# Altium schematic sheet Interfaces.SchDoc: Interfaces
size A2; ApprovedBy: Yves Chevallier; CheckedBy: Yves Chevallier; Author: Yves Chevallier; CompanyName: HEIG-VD; DrawnBy: Yves Chevallier; Engineer: Yves Chevallier; Organization: HEIG-VD; Address1: HEIG-VD; Address2: CH1015 Lausanne; Address3: +41(0)21 693 36 98; Address4: +41(0)21 693 26 00; DocumentNumber: ABC.00.0000.000.0; Revision: v1.0; SheetNumber: 0; SheetTotal: 0; DrawnByDate: 2000-01-01; ExecutionWarrantDate: 2000-01-01; ExecutionWarrant: Yves Chevallier; Context: Confidential; PageSetup: Record=PageOptions|CenterHorizontal=True|CenterVertical=False|PrintScale=0.97|XCorrection=1.00|YCorrection=1.00|PrintKind=0|BorderSize=5000000|LeftOffset=0|BottomOffset=0|Orientation=2|PaperLength=1000|PaperWidth=1000|Scale=100|PaperSource=262|PrintQuality=600|MediaType=1|DitherType=10|PaperKind=A4|PrintScaleMode=1; EngineerDate: 2000-01-01; CheckedByDate: 2000-01-01; ProjectName: PRJ
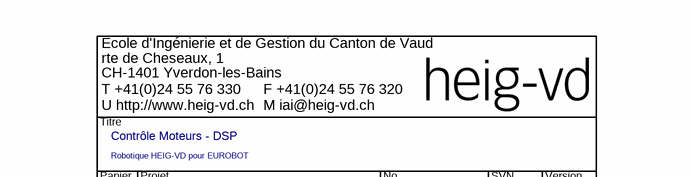
[diagram p0: Interfaces.SchDoc, top right]
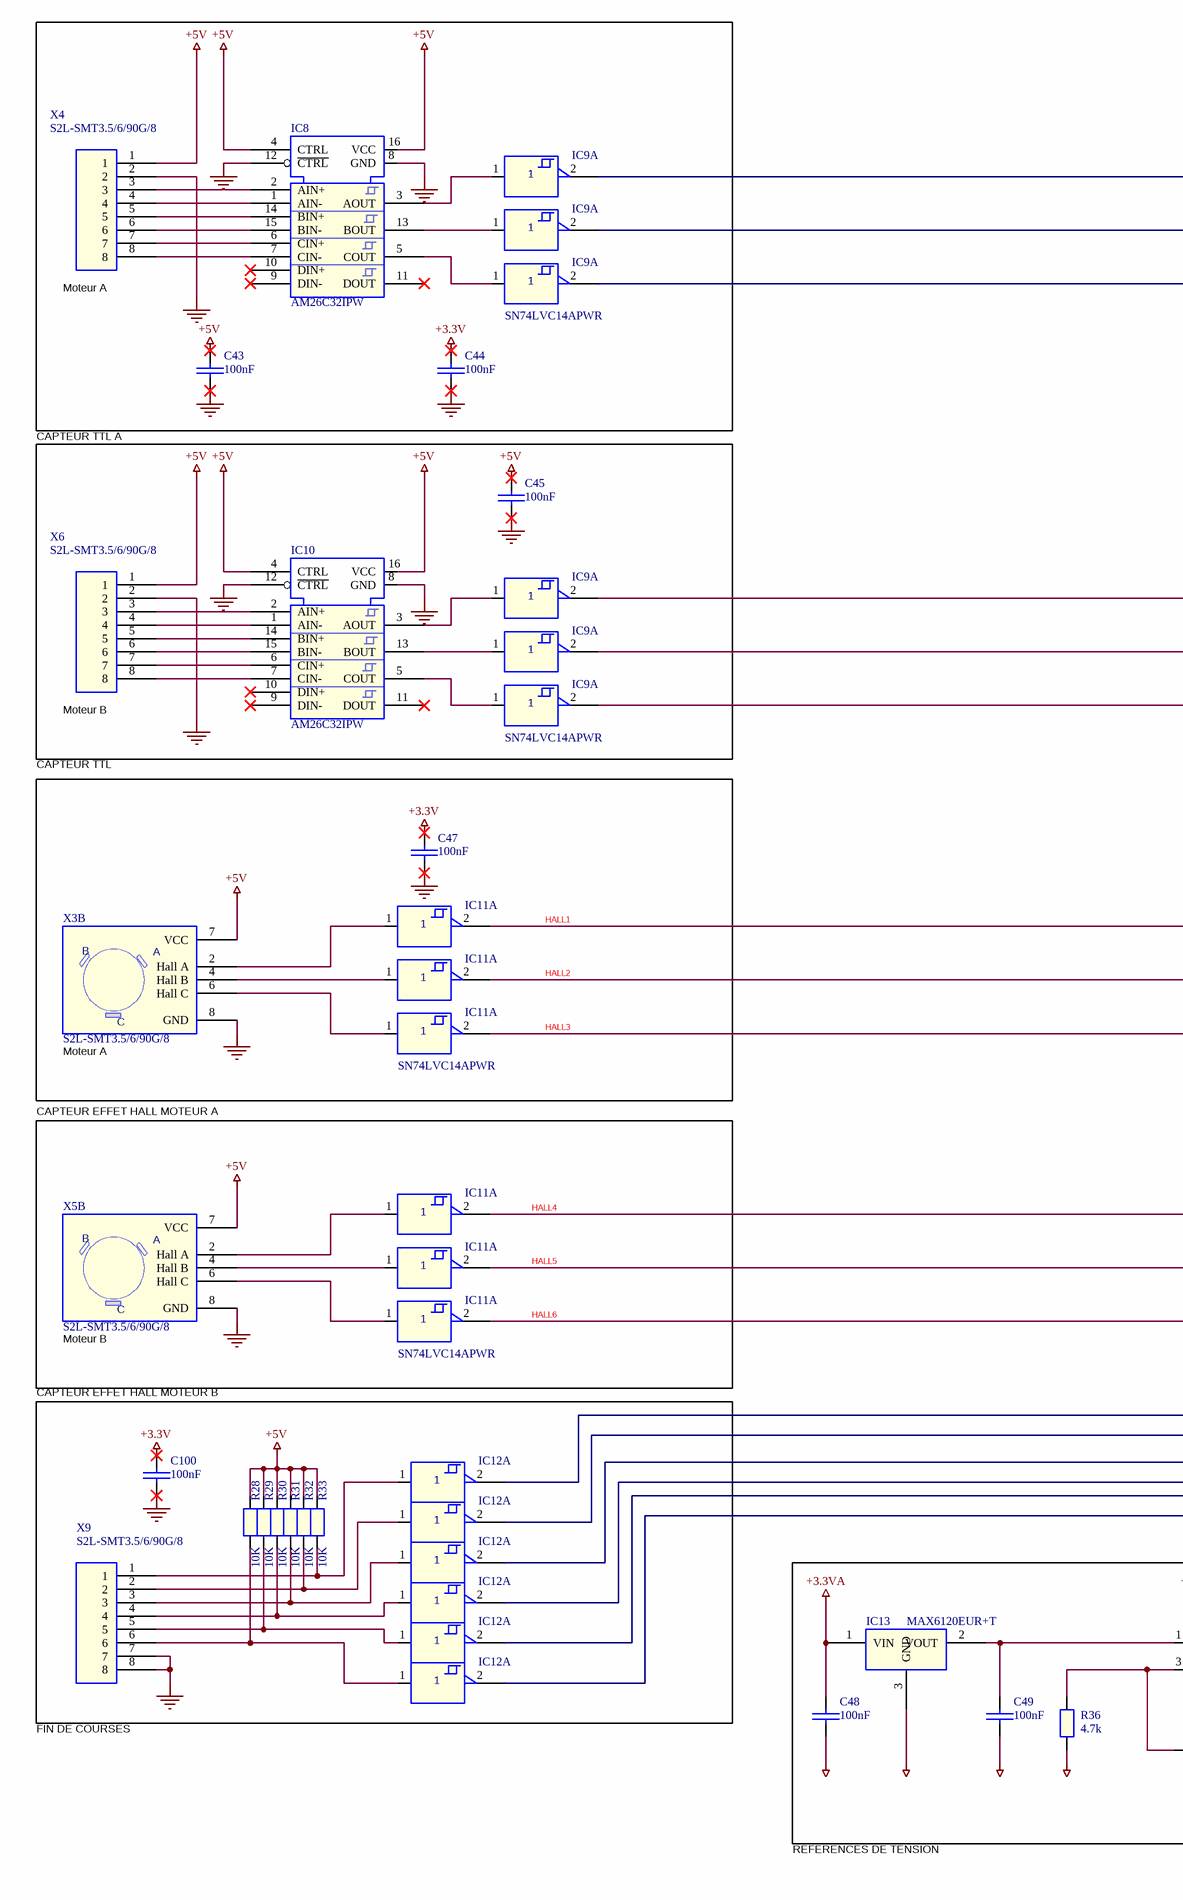
[diagram p1: Interfaces.SchDoc, bottom left]
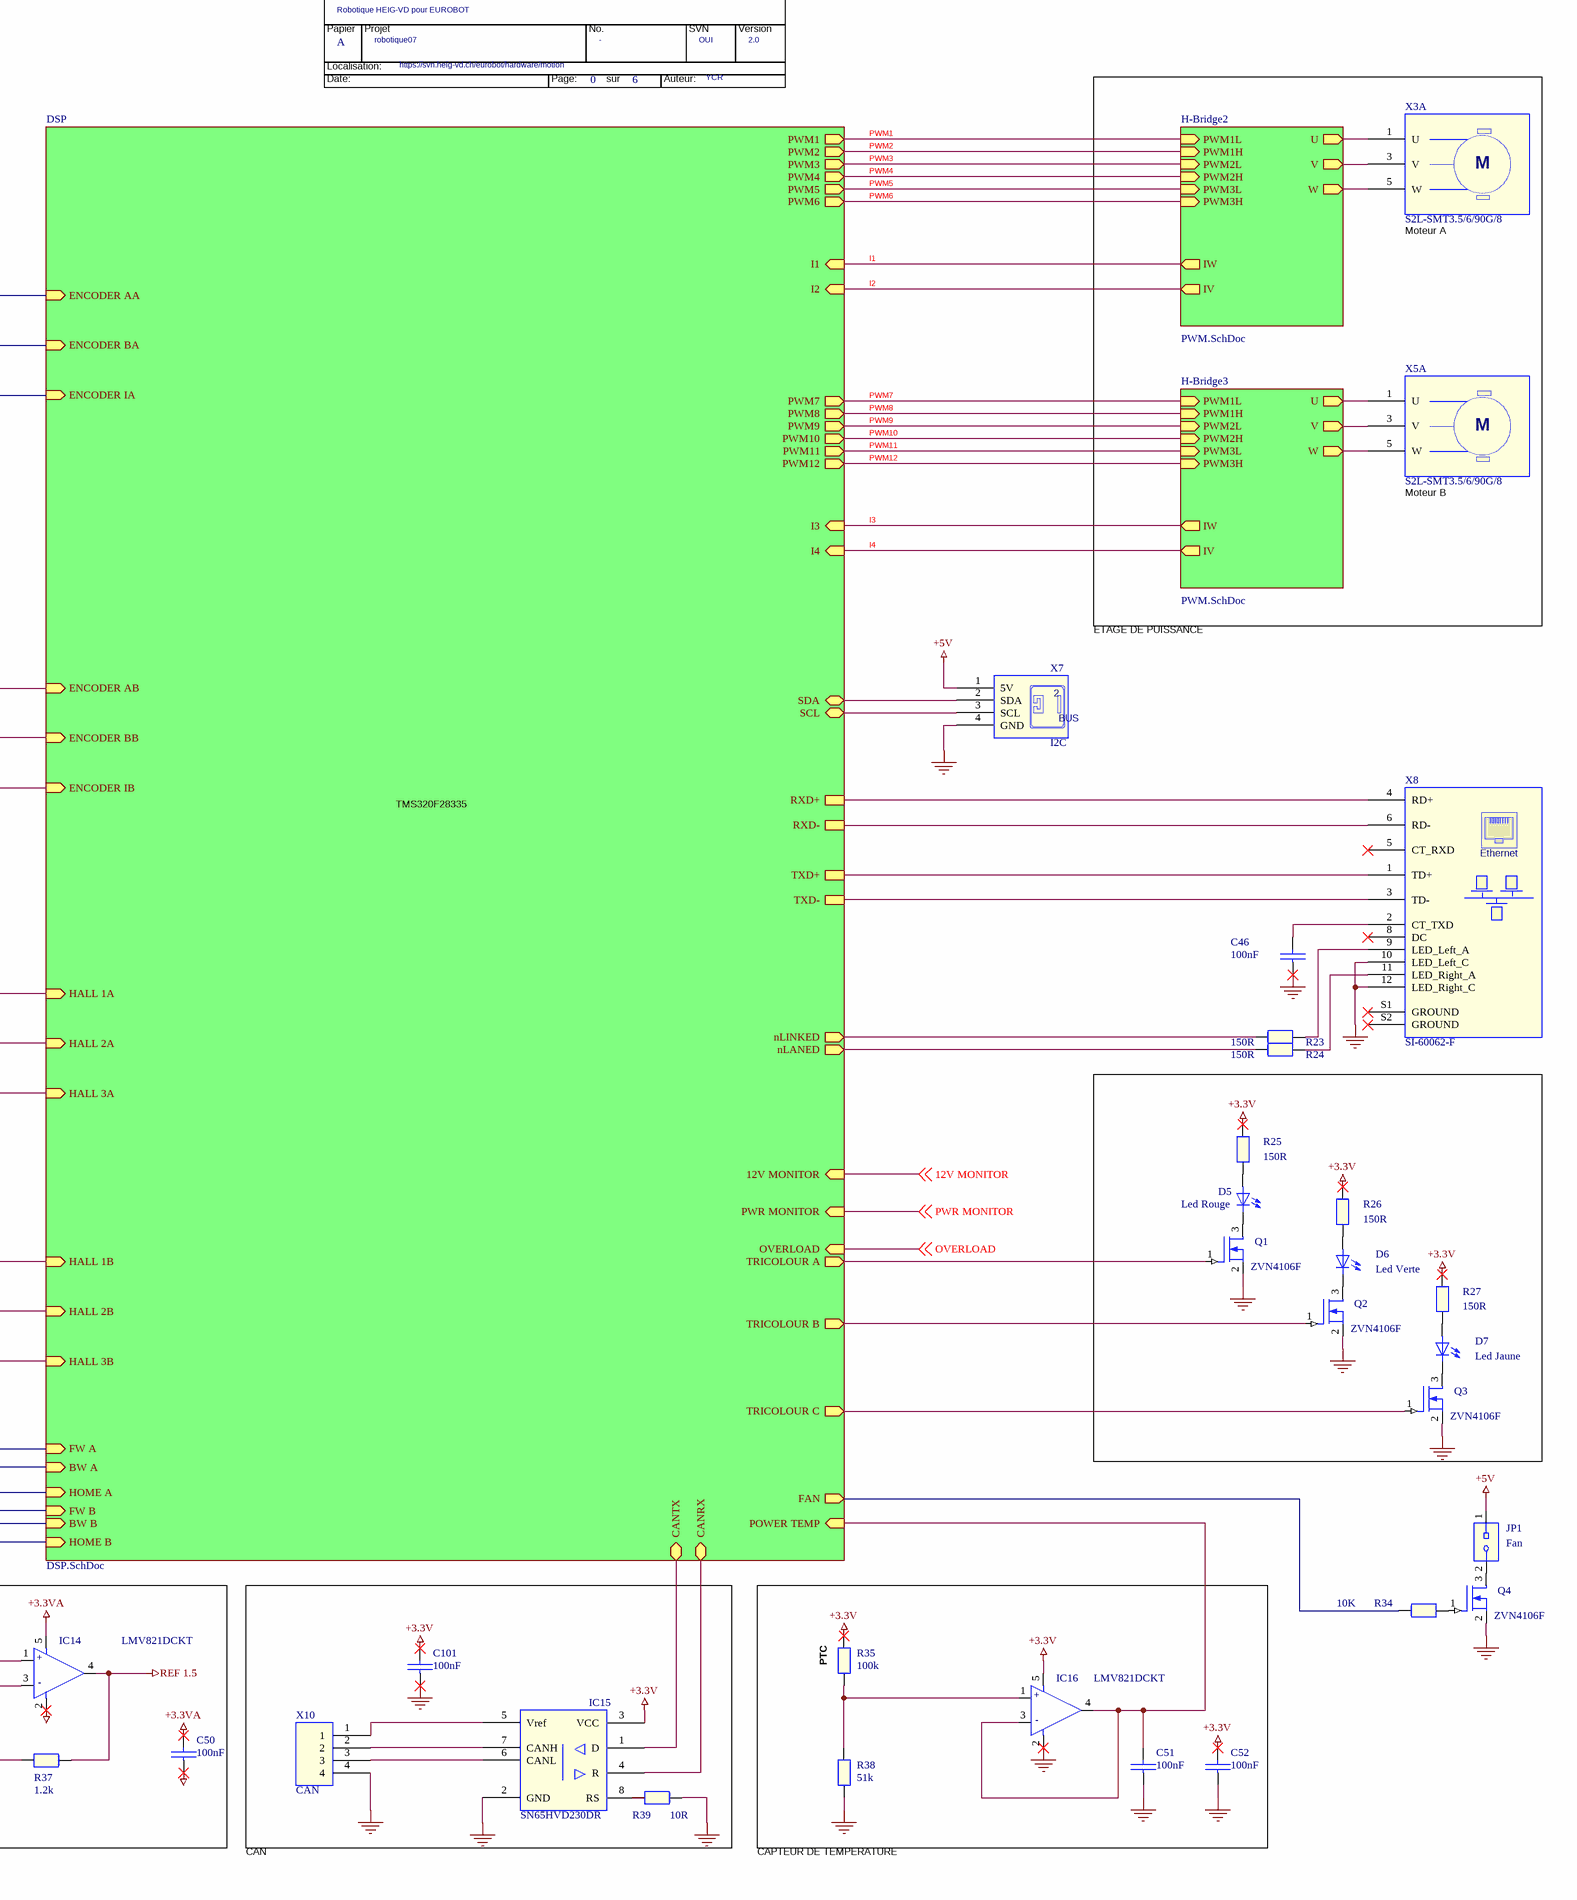
[diagram p2: Interfaces.SchDoc, bottom right]

## Parts
(Parts that share a designator on the sheet are numbered #1, #2 ... from top to bottom, then left to right.)
*  SVN: OUI  Author: YCR  Subtitle: Robotique HEIG-VD pour EUROBOT  Projet: robotique07  Page Count: 6  Page Number: 0  Page Size: A  Title: Contrôle Moteurs - DSP  RevCode: 2.0  (hidden comment: TitleBlock HEIG-VD)  (graphical)
C43  100nF  [SM/C_0805]
C44  100nF  [SM/C_0805]
C45  100nF  [SM/C_0805]
C46  100nF  [SM/C_0805]
C47  100nF  [SM/C_0805]
C48  100nF  [SM/C_0805]
C49  100nF  [SM/C_0805]
C50  100nF  [SM/C_0805]
C51  100nF  [SM/C_0805]
C52  100nF  [SM/C_0805]
C100  100nF  [SM/C_0805]
C101  100nF  [SM/C_0805]
D5  Led Rouge  [LED 5]
D6  Led Verte  [LED 5]
D7  Led Jaune  [LED 5]
IC8  AM26C32IPW  [HEIG/SM/TSSOP16]
IC9#1  SN74LVC14APWR  [SOG.65M/14/WG6.40/L5.00]  (value not drawn)  (part A of 6)
IC9#2  SN74LVC14APWR  [SOG.65M/14/WG6.40/L5.00]  (value not drawn)  (part A of 6)
IC9#3  SN74LVC14APWR  [SOG.65M/14/WG6.40/L5.00]  (part A of 6)
IC9#4  SN74LVC14APWR  [SOG.65M/14/WG6.40/L5.00]  (value not drawn)  (part A of 6)
IC9#5  SN74LVC14APWR  [SOG.65M/14/WG6.40/L5.00]  (value not drawn)  (part A of 6)
IC9#6  SN74LVC14APWR  [SOG.65M/14/WG6.40/L5.00]  (part A of 6)
IC10  AM26C32IPW  [HEIG/SM/TSSOP16]
IC11#1  SN74LVC14APWR  [SOG.65M/14/WG6.40/L5.00]  (value not drawn)  (part A of 6)
IC11#2  SN74LVC14APWR  [SOG.65M/14/WG6.40/L5.00]  (value not drawn)  (part A of 6)
IC11#3  SN74LVC14APWR  [SOG.65M/14/WG6.40/L5.00]  (part A of 6)
IC11#4  SN74LVC14APWR  [SOG.65M/14/WG6.40/L5.00]  (value not drawn)  (part A of 6)
IC11#5  SN74LVC14APWR  [SOG.65M/14/WG6.40/L5.00]  (value not drawn)  (part A of 6)
IC11#6  SN74LVC14APWR  [SOG.65M/14/WG6.40/L5.00]  (part A of 6)
IC12#1  SN74LVC14APWR  [SOG.65M/14/WG6.40/L5.00]  (value not drawn)  (part A of 6)
IC12#2  SN74LVC14APWR  [SOG.65M/14/WG6.40/L5.00]  (value not drawn)  (part A of 6)
IC12#3  SN74LVC14APWR  [SOG.65M/14/WG6.40/L5.00]  (value not drawn)  (part A of 6)
IC12#4  SN74LVC14APWR  [SOG.65M/14/WG6.40/L5.00]  (value not drawn)  (part A of 6)
IC12#5  SN74LVC14APWR  [SOG.65M/14/WG6.40/L5.00]  (value not drawn)  (part A of 6)
IC12#6  SN74LVC14APWR  [SOG.65M/14/WG6.40/L5.00]  (value not drawn)  (part A of 6)
IC13  MAX6120EUR+T  [SOT23_123]
IC14  LMV821DCKT  [HEIG/SM/SC70]
IC15  SN65HVD230DR  [SOG.050/8/WG.244/L.197]
IC16  LMV821DCKT  [HEIG/SM/SC70]
JP1  Fan  [JP2]
Q1  ZVN4106F  [SM/SOT23_123]
Q2  ZVN4106F  [SM/SOT23_123]
Q3  ZVN4106F  [SM/SOT23_123]
Q4  ZVN4106F  [SM/SOT23_123]
R23  150R  [R400]
R24  150R  [R400]
R25  150R  [R400]
R26  150R  [R400]
R27  150R  [R400]
R28  10K  [R400]
R29  10K  [R400]
R30  10K  [R400]
R31  10K  [R400]
R32  10K  [R400]
R33  10K  [R400]
R34  10K  [R400]
R35  100k  [R400]
R36  4.7k  [R400]
R37  1.2k  [R400]
R38  51k  [R400]
R39  10R  [R400]
X3  S2L-SMT3.5/6/90G/8  [Molex8]  (parts A,B of 2)
X4  S2L-SMT3.5/6/90G/8  [HEIG/CON/WDM/S2L-SMT3.5/6/90G/8]
X5  S2L-SMT3.5/6/90G/8  [Molex8]  (parts A,B of 2)
X6  S2L-SMT3.5/6/90G/8  [HEIG/CON/WDM/S2L-SMT3.5/6/90G/8]
X7  I2C  [HEIG/CONN/MICROMATCH/FEM/4]
X8  SI-60062-F  [FCC_RJ45_BLINDE_BSC_4303696]
X9  S2L-SMT3.5/6/90G/8  [HEIG/CON/WDM/S2L-SMT3.5/6/90G/8]
X10  CAN  [HEIG/MOLEX/95501-2441]

## Blocks framed on the sheet
Moteur A: C43 C44 IC8 IC9#1-IC9#3 X4
CAPTEUR EFFET HALL MOTEUR B: C100 IC12#1-IC12#6 R28-R33 X9
PTC: C51 C52 IC16 R35 R38

## Sub-sheets
DSP = DSP.SchDoc: SDA (bidir), SCL (bidir), CANRX (bidir), CANTX (bidir), PWM1 (out), PWM2 (out), PWM3 (out), PWM4 (out), PWM5 (out), PWM6 (out), PWM7 (out), PWM8 (out), PWM9 (out), PWM10 (out), PWM11 (out), PWM12 (out), I1 (in), I2 (in), I3 (in), I4 (in), HALL 1A (in), HALL 2A (in), HALL 3A (in), HALL 1B (in), HALL 2B (in), HALL 3B (in), ENCODER AA (in), ENCODER BA (in), ENCODER IA (in), ENCODER IB (in), ENCODER AB (in), ENCODER BB (in), OVERLOAD (in), TRICOLOUR A (out), TRICOLOUR B (out), TRICOLOUR C (out), FAN (out), POWER TEMP (in), FW A (in), BW A (in), HOME A (in), FW B (in), BW B (in), HOME B (in), RXD-, PWR MONITOR (in), 12V MONITOR (in), TXD+, TXD-, RXD+, nLINKED (out), nLANED (out)
H-Bridge2 = PWM.SchDoc: IV (out), PWM1H (in), PWM2H (in), PWM2L (in), PWM3H (in), PWM3L (in), PWM1L (in), IW (out), U (out), V (out), W (out)  | ReuseAnnotated: YES; R__12_PartReference: R82; IC__3_PartReference: IC29; R__PartReference: R83; R__13_PartReference: R84; R__8_PartReference: R85; C__5_PartReference: C83; R__14_PartReference: R86; D__2_PartReference: D11; Q__1_PartReference: Q11; R__15_PartReference: R87; R__9_PartReference: R88; C__8_PartReference: C85; R__16_PartReference: R89; IC__2_PartReference: IC30; IC__4_PartReference: IC29; Q__5_PartReference: Q12; Q__3_PartReference: Q13; Q__PartReference: Q14; R__4_PartReference: R90; R__22_PartReference: R91; R__10_PartReference: R92; R__20_PartReference: R93; IC__PartReference: IC31; R__17_PartReference: R94; R__1_PartReference: R95; Q__4_PartReference: Q15; R__5_PartReference: R96; C__3_PartReference: C86; R__6_PartReference: R97; C__9_PartReference: C87; C__PartReference: C88; R__18_PartReference: R98; IC__5_PartReference: IC32; Q__2_PartReference: Q16; D__1_PartReference: D12; C__6_PartReference: C89; C__10_PartReference: C90; R__2_PartReference: R99; C__1_PartReference: C91; R__21_PartReference: R100; C__2_PartReference: C92; R__11_PartReference: R101; C__4_PartReference: C93; D__PartReference: D13; IC__1_PartReference: IC33; R__7_PartReference: R102; R__19_PartReference: R103; C__11_PartReference: C94; C__7_PartReference: C95; R__3_PartReference: R104; TitleBlock_Page_Number: 0
H-Bridge3 = PWM.SchDoc: IV (out), PWM1H (in), PWM2H (in), PWM2L (in), PWM3H (in), PWM3L (in), PWM1L (in), IW (out), U (out), V (out), W (out)  | ReuseAnnotated: YES; R__12_PartReference: R59; IC__3_PartReference: IC24; R__PartReference: R60; R__13_PartReference: R61; R__8_PartReference: R62; C__5_PartReference: C70; R__14_PartReference: R63; D__2_PartReference: D8; Q__1_PartReference: Q5; R__15_PartReference: R64; R__9_PartReference: R65; C__8_PartReference: C72; R__16_PartReference: R66; IC__2_PartReference: IC25; IC__4_PartReference: IC24; Q__5_PartReference: Q6; Q__3_PartReference: Q7; Q__PartReference: Q8; R__4_PartReference: R67; R__22_PartReference: R68; R__10_PartReference: R69; R__20_PartReference: R70; IC__PartReference: IC26; R__17_PartReference: R71; R__1_PartReference: R72; Q__4_PartReference: Q9; R__5_PartReference: R73; C__3_PartReference: C73; R__6_PartReference: R74; C__9_PartReference: C74; C__PartReference: C75; R__18_PartReference: R75; IC__5_PartReference: IC27; Q__2_PartReference: Q10; D__1_PartReference: D9; C__6_PartReference: C76; C__10_PartReference: C77; R__2_PartReference: R76; C__1_PartReference: C78; R__21_PartReference: R77; C__2_PartReference: C79; R__11_PartReference: R78; C__4_PartReference: C80; D__PartReference: D10; IC__1_PartReference: IC28; R__7_PartReference: R79; R__19_PartReference: R80; C__11_PartReference: C81; C__7_PartReference: C82; R__3_PartReference: R81; TitleBlock_Page_Number: 1

## Nets
+3.3V: C44.1 C47.1 C52.1 C100.1 C101.1 IC15.3(VCC) IC16.5(VCC) R25.1 R26.1 R27.1 R35.2
+3.3VA: C48.1 C50.1 IC13.1(VIN) IC14.5(VCC)
+5V: C43.1 C45.1 IC8.4(CTRL) IC8.16(VCC) IC10.4(CTRL) IC10.16(VCC) JP1.1 R28.2 R29.2 R30.2 R31.2 R32.2 R33.2 X3.7(VCC) X4.1 X5.7(VCC) X6.1 X7.1(5V)
AGND: C48.2 C49.2 C50.2 IC13.3(GND) IC14.2(GND) R36.1
GND: C43.2 C44.2 C45.2 C46.2 C47.2 C51.2 C52.2 C100.2 C101.2 IC8.8(GND) IC8.12(~{CTRL}) IC9#1.7(GND) IC9#2.7(GND) IC9#3.7(GND) IC9#4.7(GND) IC9#5.7(GND) IC9#6.7(GND) IC10.8(GND) IC10.12(~{CTRL}) IC11#1.7(GND) IC11#2.7(GND) IC11#3.7(GND) IC11#4.7(GND) IC11#5.7(GND) IC11#6.7(GND) IC12#1.7(GND) IC12#2.7(GND) IC12#3.7(GND) IC12#4.7(GND) IC12#5.7(GND) IC12#6.7(GND) IC15.2(GND) IC16.2(GND) Q1.2(SOURCE) Q2.2(SOURCE) Q3.2(SOURCE) Q4.2(SOURCE) R38.1 R39.1 X3.8(GND) X4.2 X5.8(GND) X6.2 X7.4(GND) X8.10(LED_Left_C) X8.12(LED_Right_C) X9.7 X9.8 X10.4
REF 1.5: IC14.4(out) R37.1
VCC: IC9#1.14(VCC) IC9#2.14(VCC) IC9#3.14(VCC) IC9#4.14(VCC) IC9#5.14(VCC) IC9#6.14(VCC) IC11#1.14(VCC) IC11#2.14(VCC) IC11#3.14(VCC) IC11#4.14(VCC) IC11#5.14(VCC) IC11#6.14(VCC) IC12#1.14(VCC) IC12#2.14(VCC) IC12#3.14(VCC) IC12#4.14(VCC) IC12#5.14(VCC) IC12#6.14(VCC)
12V MONITOR: off-sheet 12V MONITOR, sheet DSP/12V MONITOR
HALL1: IC11#1.2(6Y) ; sheet DSP/HALL 1A
HALL2: IC11#2.2(6Y) ; sheet DSP/HALL 2A
HALL3: IC11#3.2(6Y) ; sheet DSP/HALL 3A
HALL4: IC11#4.2(6Y) ; sheet DSP/HALL 1B
HALL5: IC11#5.2(6Y) ; sheet DSP/HALL 2B
HALL6: IC11#6.2(6Y) ; sheet DSP/HALL 3B
I1: sheet DSP/I1, sheet H-Bridge2/IW
I2: sheet DSP/I2, sheet H-Bridge2/IV
I3: sheet DSP/I3, sheet H-Bridge3/IW
I4: sheet DSP/I4, sheet H-Bridge3/IV
OVERLOAD: off-sheet OVERLOAD, sheet DSP/OVERLOAD
PWM1: sheet DSP/PWM1, sheet H-Bridge2/PWM1L
PWM2: sheet DSP/PWM2, sheet H-Bridge2/PWM1H
PWM3: sheet DSP/PWM3, sheet H-Bridge2/PWM2L
PWM4: sheet DSP/PWM4, sheet H-Bridge2/PWM2H
PWM5: sheet DSP/PWM5, sheet H-Bridge2/PWM3L
PWM6: sheet DSP/PWM6, sheet H-Bridge2/PWM3H
PWM7: sheet DSP/PWM7, sheet H-Bridge3/PWM1L
PWM8: sheet DSP/PWM8, sheet H-Bridge3/PWM1H
PWM9: sheet DSP/PWM9, sheet H-Bridge3/PWM2L
PWM10: sheet DSP/PWM10, sheet H-Bridge3/PWM2H
PWM11: sheet DSP/PWM11, sheet H-Bridge3/PWM3L
PWM12: sheet DSP/PWM12, sheet H-Bridge3/PWM3H
PWR MONITOR: off-sheet PWR MONITOR, sheet DSP/PWR MONITOR
NetC46_1: C46.1 X8.2(CT_TXD)
NetC49_1: C49.1 IC13.2(VOUT) IC14.1(IN+)
NetC51_1: C51.1 IC16.3(IN-) IC16.4(out) ; sheet DSP/POWER TEMP
NetD5_1: D5.1 Q1.3(DRAIN)
NetD5_2: D5.2 R25.2
NetD6_1: D6.1 Q2.3(DRAIN)
NetD6_2: D6.2 R26.2
NetD7_1: D7.1 Q3.3(DRAIN)
NetD7_2: D7.2 R27.2
NetIC8_1: IC8.1(AIN-) X4.4
NetIC8_2: IC8.2(AIN+) X4.3
NetIC8_3: IC8.3(AOUT) IC9#1.1(6A)
NetIC8_5: IC8.5(COUT) IC9#3.1(6A)
NetIC8_6: IC8.6(CIN+) X4.7
NetIC8_7: IC8.7(CIN-) X4.8
NetIC8_13: IC8.13(BOUT) IC9#2.1(6A)
NetIC8_14: IC8.14(BIN+) X4.5
NetIC8_15: IC8.15(BIN-) X4.6
NetIC9#1_2: IC9#1.2(6Y) ; sheet DSP/ENCODER AA
NetIC9#2_2: IC9#2.2(6Y) ; sheet DSP/ENCODER BA
NetIC9#3_2: IC9#3.2(6Y) ; sheet DSP/ENCODER IA
NetIC9#4_1: IC9#4.1(6A) IC10.3(AOUT)
NetIC9#4_2: IC9#4.2(6Y) ; sheet DSP/ENCODER AB
NetIC9#5_1: IC9#5.1(6A) IC10.13(BOUT)
NetIC9#5_2: IC9#5.2(6Y) ; sheet DSP/ENCODER BB
NetIC9#6_1: IC9#6.1(6A) IC10.5(COUT)
NetIC9#6_2: IC9#6.2(6Y) ; sheet DSP/ENCODER IB
NetIC10_1: IC10.1(AIN-) X6.4
NetIC10_2: IC10.2(AIN+) X6.3
NetIC10_6: IC10.6(CIN+) X6.7
NetIC10_7: IC10.7(CIN-) X6.8
NetIC10_14: IC10.14(BIN+) X6.5
NetIC10_15: IC10.15(BIN-) X6.6
NetIC11#1_1: IC11#1.1(6A) X3.2(Hall_A)
NetIC11#2_1: IC11#2.1(6A) X3.4(Hall_B)
NetIC11#3_1: IC11#3.1(6A) X3.6(Hall_C)
NetIC11#4_1: IC11#4.1(6A) X5.2(Hall_A)
NetIC11#5_1: IC11#5.1(6A) X5.4(Hall_B)
NetIC11#6_1: IC11#6.1(6A) X5.6(Hall_C)
NetIC12#1_1: IC12#1.1(6A) R33.1 X9.1
NetIC12#1_2: IC12#1.2(6Y) ; sheet DSP/FW A
NetIC12#2_1: IC12#2.1(6A) R32.1 X9.2
NetIC12#2_2: IC12#2.2(6Y) ; sheet DSP/BW A
NetIC12#3_1: IC12#3.1(6A) R31.1 X9.3
NetIC12#3_2: IC12#3.2(6Y) ; sheet DSP/HOME A
NetIC12#4_1: IC12#4.1(6A) R30.1 X9.4
NetIC12#4_2: IC12#4.2(6Y) ; sheet DSP/FW B
NetIC12#5_1: IC12#5.1(6A) R29.1 X9.5
NetIC12#5_2: IC12#5.2(6Y) ; sheet DSP/BW B
NetIC12#6_1: IC12#6.1(6A) R28.1 X9.6
NetIC12#6_2: IC12#6.2(6Y) ; sheet DSP/HOME B
NetIC14_3: IC14.3(IN-) R36.2 R37.2
NetIC15_1: IC15.1(D) ; sheet DSP/CANTX
NetIC15_4: IC15.4(R) ; sheet DSP/CANRX
NetIC15_5: IC15.5(Vref) X10.1
NetIC15_6: IC15.6(CANL) X10.3
NetIC15_7: IC15.7(CANH) X10.2
NetIC15_8: IC15.8(RS) R39.2
NetIC16_1: IC16.1(IN+) R35.1 R38.2
NetJP1_2: JP1.2 Q4.3(DRAIN)
NetQ1_1: Q1.1(GATE) ; sheet DSP/TRICOLOUR A
NetQ2_1: Q2.1(GATE) ; sheet DSP/TRICOLOUR B
NetQ3_1: Q3.1(GATE) ; sheet DSP/TRICOLOUR C
NetQ4_1: Q4.1(GATE) R34.2
NetR23_1: R23.1 ; sheet DSP/nLINKED
NetR23_2: R23.2 X8.9(LED_Left_A)
NetR24_1: R24.1 ; sheet DSP/nLANED
NetR24_2: R24.2 X8.11(LED_Right_A)
NetR34_1: R34.1 ; sheet DSP/FAN
NetX3_1: X3.1(U) ; sheet H-Bridge2/U
NetX3_3: X3.3(V) ; sheet H-Bridge2/V
NetX3_5: X3.5(W) ; sheet H-Bridge2/W
NetX5_1: X5.1(U) ; sheet H-Bridge3/U
NetX5_3: X5.3(V) ; sheet H-Bridge3/V
NetX5_5: X5.5(W) ; sheet H-Bridge3/W
NetX7_2: X7.2(SDA) ; sheet DSP/SDA
NetX7_3: X7.3(SCL) ; sheet DSP/SCL
NetX8_1: X8.1(TD+) ; sheet DSP/TXD+
NetX8_3: X8.3(TD-) ; sheet DSP/TXD-
NetX8_4: X8.4(RD+) ; sheet DSP/RXD+
NetX8_6: X8.6(RD-) ; sheet DSP/RXD-

Not connected (* = marked no-connect by the designer): IC8 9(DIN-)* 10(DIN+)* 11(DOUT)*; IC10 9(DIN-)* 10(DIN+)* 11(DOUT)*; X8 5(CT_RXD)* 8(DC)* S1(GROUND)* S2(GROUND)*

## Notes on the sheet
- (near X3) Moteur A
- (near X5) Moteur B
- CAPTEUR TTL A
- ETAGE DE PUISSANCE
- (near X6) Moteur B
- TMS320F28335
- CAPTEUR TTL
- Moteur A
- CAPTEUR EFFET HALL MOTEUR A
- Moteur B
- FIN DE COURSES
- REFERENCES DE TENSION
- CAN
- CAPTEUR DE TEMPERATURE
- Title
- HES-SO / HEIG-VD / TIN / IAI
  Route de Cheseaux, 1
  CH-1401 Yverdon-les-Bains
  T +41 24 557 73 77    F +41 24 557 63 20
  http://iai.heig-vd.ch
  iai@heig-vd.ch
- Size
- Date
- File
- A4
- Project
- Sheet
- of
- No.
- Author
- SVN/Git
- Version
- (in symbol Connecteur Moteur_2, part A) M
- (in symbol Connecteur Moteur_2, part B) B; A; C
- (in symbol I2C) BUS
- (in symbol LMV821DCKT_1) +; -
- (in symbol LU1T041-43_3) Ethernet
- (in symbol TitleBlock HEIG-VD) Ecole d'Ingénierie et de Gestion du Canton de Vaud; rte de Cheseaux, 1; CH-1401 Yverdon-les-Bains; T +41(0)24 55 76 330; F +41(0)24 55 76 320; U http://www.heig-vd.ch; M iai@heig-vd.ch; Titre; Papier; Projet; No.; SVN; Version; Localisation:; Date:; Page:; sur; Auteur:

## Library data of the parts
* = TitleBlock HEIG-VD: OrgName: Institut d'automatisation Industrielle; OrgAddr3: 1400 Yverdon-les-Bains; Location: https://svn.heig-vd.ch/eurobot/hardware/motion; No Projet: -; Page Create Date: March  8, 1995
C43 C44 C51 = C_Dup1: Quantité min: 10; Fabricant: PHYCOMP; Ref. Fabricant: 2238 786 15649; Prix: 0.06; Ref. Fab: AVX; PCB Footprint: HEIG/SM/C_0603; Distributeur: Farnell; Ref. Distributeur: 432210; Distributor: Farnell; Price in €: 0.140; Ref. Distributor: 499-687
C45 C52 = C_Dup1: Quantité min: 10; Fabricant: PHYCOMP; Ref. Fab: AVX; Prix: 0.06; Ref. Fabricant: 2238 786 15649; PCB Footprint: HEIG/SM/C_0603; Ref. Distributor: 499-687; Price in €: 0.140; Distributor: Farnell; Ref. Distributeur: 432210; Distributeur: Farnell
C46 = C: Quantité min: 10; Ref. Fabricant: 2238 786 15649; Fabricant: PHYCOMP; Prix: 0.06; PCB Footprint: HEIG/SM/C_0805; Ref. Distributeur: 432210; Distributeur: Farnell
C47-C49 = C_Dup1: Ref. Fabricant: 2238 786 15649; Prix: 0.06; Ref. Fab: AVX; Fabricant: PHYCOMP; Quantité min: 10; PCB Footprint: HEIG/SM/C_0603; Distributeur: Farnell; Ref. Distributeur: 432210; Distributor: Farnell; Price in €: 0.140; Ref. Distributor: 499-687
C50 = C_Dup1: Ref. Fab: AVX; Prix: 0.06; Ref. Fabricant: 2238 786 15649; Fabricant: PHYCOMP; Quantité min: 10; PCB Footprint: HEIG/SM/C_0603; Ref. Distributor: 499-687; Price in €: 0.140; Distributor: Farnell; Ref. Distributeur: 432210; Distributeur: Farnell
C100 C101 = C_Dup1: PCB Footprint: HEIG/SM/C_0603; Ref. Fabricant: 2238 786 15649; Prix: 0.06; Ref. Fab: AVX; Fabricant: PHYCOMP; Quantité min: 10; Distributeur: Farnell; Ref. Distributeur: 432210; Distributor: Farnell; Price in €: 0.140; Ref. Distributor: 499-687
D5 = Led_0: Quantité min: 1; Fabricant: VISHAY; PCB Footprint: PLCC_2; Ref. Fab: QTLP670C-2... FAIRCHILD SEMICONDUCTOR; Ref. Fabricant: TLMT3100-GS08; Prix: 0.49; Distributor: Farnell; Ref. Distributor: 3599917; Price in €: 0.144; Ref. Distributeur: 1045493; Distributeur: Farnell
D6 = Led_0: Quantité min: 1; Fabricant: VISHAY; PCB Footprint: PLCC_2; Ref. Fab: QTLP670C-2... FAIRCHILD SEMICONDUCTOR; Ref. Fabricant: TLMC3100-GS08; Prix: 0.408; Distributor: Farnell; Ref. Distributor: 3599917; Price in €: 0.144; Ref. Distributeur: 1213159; Distributeur: Farnell
D7 = Led_0: Quantité min: 1; Fabricant: VISHAY; PCB Footprint: PLCC_2; Ref. Fab: QTLP670C-2... FAIRCHILD SEMICONDUCTOR; Prix: 0.15; Ref. Fabricant: TLMA3100-GS08.; Distributor: Farnell; Ref. Distributor: 3599917; Price in €: 0.144; Ref. Distributeur: 8311242; Distributeur: Farnell
IC8 IC10 = AM26LS32_2: Prix: 1.50; Fabricant: TEXAS INSTRUMENTS; Quantité min: 1; Ref. Distributor: 1103045; Ref. Distributeur: AM26C32IPW; Distributeur: TEXAS INSTRUMENTS; Ref. Fabricant: AM26C32IPW; PCB Footprint: HEIG/SM/TSSOP16
IC9#1-IC9#6 IC11#1-IC11#6 = 7414: Quantité min: 1; Fabricant: TEXAS INSTRUMENTS; Prix: 0.968; PCB Footprint: SOG.65M/14/WG6.40/L5.00; Ref. Distributeur: 1102979; Ref. Fabricant: SN74LVC14APWR; Distributeur: Farnell; Distributor: Spoerle
IC12#1-IC12#6 = 7414: Prix: 0.968; Fabricant: TEXAS INSTRUMENTS; Quantité min: 1; PCB Footprint: SOG.65M/14/WG6.40/L5.00; Distributor: Spoerle; Distributeur: Farnell; Ref. Fabricant: SN74LVC14APWR; Ref. Distributeur: 1102979
IC13 = MAX6120: PCB Footprint: HEIG/SM/SOT23; Prix: 4.65; Fabricant: MAXIM; Quantité min: 1; Ref. Fabricant: MAX6120EUR+T; Ref. Distributeur: 1188066; Distributeur: Farnell
IC14 IC16 = LMV821DCKT_1: Ref. Fabricant: LMV821IDCKTE4; Fabricant: TEXAS INSTRUMENTS; Prix: 1.45; PCB Footprint: HEIG/SM/SC70; Ref. Distributeur: 1053752; Distributeur: Farnell
IC15 = SN65HVD230_1: Prix: 6.05; Fabricant: TEXAS INSTRUMENTS; Quantité min: 1; PCB Footprint: SOG.050/8/WG.244/L.197; Distributeur: Farnell; Ref. Distributeur: 8452148; Ref. Fabricant: SN65HVD230DR
JP1 = Jumpers 1x: PCB Footprint: CON_002; Prix: 0; Ref. Fab: 75160-101-36 FCI; Ref. Fabricant: -; Ref. Distributeur: -; Distributeur: -; Price in €: 3.94; Ref. Distributor: 528419; Distributor: Farnell
Q1-Q3 = MOSFET N_0: MEMORY: NO; Prix: 1.25; Fabricant: ZETEX; Quantité min: 5; Ref. Distributeur: 9526250; Ref. Fabricant: ZVN4106F; Distributeur: Farnell; PCB Footprint: SM/SOT23_123
Q4 = MOSFET N_0: Prix: 1.25; MEMORY: NO; Fabricant: ZETEX; Quantité min: 5; Distributeur: Farnell; Ref. Fabricant: ZVN4106F; Ref. Distributeur: 9526250; PCB Footprint: SM/SOT23_123
R23 R24 = R_Dup1: PCB Footprint: HEIG/SM/R_0603; Prix: 0.064; Fabricant: MC 0.063W 0603 5% 150R; Ref. Fabricant: MULTICOMP; Quantité min: 50; Distributeur: Farnell; Ref. Distributeur: 9331794
R25-R27 = R_Dup1: PCB Footprint: HEIG/SM/R_0603; Quantité min: 50; Fabricant: MC 0.063W 0603 5% 150R; Ref. Fabricant: MULTICOMP; Prix: 0.064; Tolerance: 0.1%; Ref. Distributeur: 9331794; Distributeur: Farnell; Distributor: Farnell; Ref. Fab: multicomp; Price in €: 0.037; Ref. Distributor: 613-587
R28-R33 = R_Dup1: PCB Footprint: HEIG/SM/R_0603; Quantité min: 50; Fabricant: MULTICOMP; Ref. Fabricant: MC 0.063W 0603 5% 150R; Prix: 0.064; Tolerance: 0.1%; Ref. Distributeur: 9331794; Distributeur: Farnell; Distributor: Farnell; Ref. Fab: multicomp; Price in €: 0.037; Ref. Distributor: 613-587
R34 = R_Dup1: PCB Footprint: HEIG/SM/R_0603; Tolerance: 0.1%; Ref. Fab: multicomp; Prix: 0.064; Ref. Fabricant: MC 0.063W 0603 5% 150R; Quantité min: 50; Ref. Distributor: 613-587; Price in €: 0.037; Distributor: Farnell; Distributeur: Farnell; Ref. Distributeur: 9331794; Fabricant: MULTICOMP
R35 = R_Dup1: Quantité min: 1; Fabricant: VISHAY BC COMPONENTS; PCB Footprint: PTC_POWER; Ref. Fabricant: 238164054104; Prix: 2.55; Distributeur: Farnell; Ref. Distributeur: 1187037
R36 = R_Dup1: Prix: 0.064; Ref. Fabricant: MC 0.063W 0603 5% 4K7; Fabricant: MULTICOMP; Quantité min: 50; PCB Footprint: HEIG/SM/R_0603; Ref. Distributeur: 9332154; Distributeur: Farnell
R37 = R_Dup1: Prix: 0.064; Ref. Fabricant: MC 0.063W 0603 5% 1K2; Fabricant: MULTICOMP; Quantité min: 50; PCB Footprint: HEIG/SM/R_0603; Ref. Distributeur: 9331751; Distributeur: Farnell
R38 = R_Dup1: Tolérance: 1%; Prix: 0.064; Ref. Fabricant: MC 0.1W 0805 1% 51K; Fabricant: MULTICOMP; Quantité min: 50; PCB Footprint: SM/C_0805; Ref. Distributeur: 9333339; Distributeur: Farnell
R39 = R_Dup1: PCB Footprint: HEIG/SM/R_0603; Quantité min: 50; Fabricant: MULTICOMP; Tolerance: 0.1%; Prix: 0.064; Ref. Fabricant: MC 0.125W 1206 5% 10R; Distributeur: Farnell; Ref. Distributeur: 9336982
X3 X5 = Connecteur Moteur_2: Ref. Fab: 43045-0800; Prix: 5.27; Fabricant: Weidmüller; Quantité min: 1; PCB Footprint: HEIG/CON/WDM/S2L-SMT3.5/6/90G/8; Ref. Distributor: 43045-0800; Distributor: Farnell; Price in €: 1012254; Distributeur: Distrelec; Ref. Distributeur: 141637; Ref. Fabricant: S2L-SMT3.5/6/90G/8
X4 = Connecteur 08: Fabricant: Weidmüller; Prix: 5.27; Quantité min: 1; Distributeur: Distrelec; Ref. Distributeur: 141637; Ref. Fabricant: S2L-SMT3.5/6/90G/8; PCB Footprint: HEIG/CON/WDM/S2L-SMT3.5/6/90G/8
X6 X9 = Connecteur 08: Quantité min: 1; Prix: 5.27; Fabricant: Weidmüller; Ref. Fabricant: S2L-SMT3.5/6/90G/8; Ref. Distributeur: 141637; Distributeur: Distrelec; PCB Footprint: HEIG/CON/WDM/S2L-SMT3.5/6/90G/8
X7 = I2C: Quantité min: 10; Fabricant: TYCO ELECTRONICS / AMP; Ref. Fabricant: 7-215079-4; Prix: 0.44; Distributeur: Farnell; Ref. Distributeur: 148507; PCB Footprint: HEIG/CONN/MICROMATCH/FEM/4
X8 = LU1T041-43_3: Quantité min: 1; Prix: 10.15; Fabricant: STEWART CONNECTOR; Ref. Fabricant: SI-60062-F; Ref. Distributeur: 1137983; Distributeur: Farnell; PCB Footprint: FCC_RJ45_BLINDE_BSC_4303696
X10 = Connecteur 04: Quantité min: 1; Fabricant: MOLEX; Prix: 2; Ref. Fabricant: 95501-2441; Distributeur: Farnell; Ref. Distributeur: 1560167; PCB Footprint: HEIG/MOLEX/95501-2441